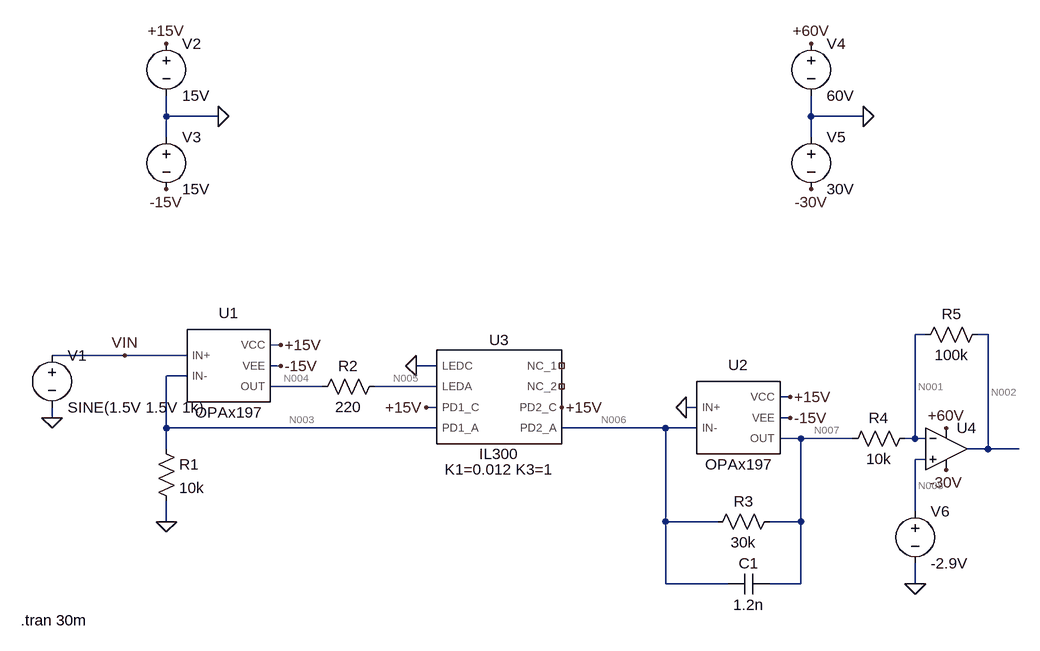
[diagram p0: schematic amplifier.asc]
amplifier.asc, the LTspice schematic file:
Version 4.1
SHEET 1 1092 680
WIRE -224 -272 -224 -304
WIRE -144 -272 -224 -272
WIRE 768 -272 768 -304
WIRE 848 -272 768 -272
WIRE -224 -240 -224 -272
WIRE 768 -240 768 -272
WIRE 944 64 928 64
WIRE 1040 64 1024 64
WIRE -48 80 -64 80
WIRE -288 96 -400 96
WIRE -192 96 -288 96
WIRE -48 112 -64 112
WIRE 192 112 160 112
WIRE -192 128 -224 128
WIRE 16 144 -64 144
WIRE 192 144 96 144
WIRE 736 160 720 160
WIRE 192 176 176 176
WIRE 592 176 576 176
WIRE -400 192 -400 176
WIRE 736 192 720 192
WIRE -224 208 -224 128
WIRE 192 208 -224 208
WIRE 544 208 384 208
WIRE 592 208 544 208
WIRE 752 224 720 224
WIRE 832 224 752 224
WIRE 928 224 928 64
WIRE 928 224 912 224
WIRE 944 224 928 224
WIRE -224 240 -224 208
WIRE 1040 240 1040 64
WIRE 1040 240 1008 240
WIRE 1088 240 1040 240
WIRE 944 256 928 256
WIRE 928 336 928 256
WIRE -224 352 -224 320
WIRE 544 352 544 208
WIRE 624 352 544 352
WIRE 752 352 752 224
WIRE 752 352 704 352
WIRE 544 448 544 352
WIRE 640 448 544 448
WIRE 752 448 752 352
WIRE 752 448 704 448
WIRE 928 448 928 416
FLAG -400 192 0
FLAG 160 112 0
FLAG -144 -272 0
FLAG -224 -160 -15V
FLAG -224 -384 +15V
FLAG -48 80 +15V
FLAG 176 176 +15V
FLAG -224 352 0
FLAG 384 176 +15V
FLAG 576 176 0
FLAG 736 160 +15V
FLAG 736 192 -15V
FLAG -48 112 -15V
FLAG 848 -272 0
FLAG 768 -160 -30V
FLAG 768 -384 +60V
FLAG 976 208 +60V
FLAG 976 272 -30V
FLAG 928 448 0
FLAG -288 96 VIN
SYMBOL library\\OPAx197 -128 112 R0
SYMATTR InstName U1
SYMBOL library\\OPAx197 656 192 R0
SYMATTR InstName U2
SYMBOL library\\IL300 288 160 R0
SYMATTR InstName U3
SYMBOL res -240 224 R0
SYMATTR InstName R1
SYMATTR Value 10k
SYMBOL res 112 128 R90
WINDOW 0 0 56 VBottom 2
WINDOW 3 32 56 VTop 2
SYMATTR InstName R2
SYMATTR Value 220
SYMBOL voltage -224 -400 R0
WINDOW 123 0 0 Left 0
WINDOW 39 0 0 Left 0
SYMATTR InstName V2
SYMATTR Value 15V
SYMBOL voltage -224 -256 R0
SYMATTR InstName V3
SYMATTR Value 15V
SYMBOL res 720 336 R90
WINDOW 0 0 56 VBottom 2
WINDOW 3 32 56 VTop 2
SYMATTR InstName R3
SYMATTR Value 30k
SYMBOL cap 704 432 R90
WINDOW 0 0 32 VBottom 2
WINDOW 3 32 32 VTop 2
SYMATTR InstName C1
SYMATTR Value 1.2n
SYMBOL voltage -400 80 R0
WINDOW 123 0 0 Left 0
WINDOW 39 0 0 Left 0
SYMATTR InstName V1
SYMATTR Value SINE(1.5V 1.5V 1k)
SYMBOL OpAmps\\UniversalOpAmp 976 240 R0
SYMATTR InstName U4
SYMBOL voltage 768 -400 R0
WINDOW 123 0 0 Left 0
WINDOW 39 0 0 Left 0
SYMATTR InstName V4
SYMATTR Value 60V
SYMBOL voltage 768 -256 R0
SYMATTR InstName V5
SYMATTR Value 30V
SYMBOL res 928 208 R90
WINDOW 0 0 56 VBottom 2
WINDOW 3 32 56 VTop 2
SYMATTR InstName R4
SYMATTR Value 10k
SYMBOL res 1040 48 R90
WINDOW 0 0 56 VBottom 2
WINDOW 3 32 56 VTop 2
SYMATTR InstName R5
SYMATTR Value 100k
SYMBOL voltage 928 320 R0
SYMATTR InstName V6
SYMATTR Value -2.9V
TEXT -448 504 Left 2 !.tran 30m

The netlist it stands for:
* amplifier.asc
X§U1 VIN N003 +15V -15V N004 OPAx197  ; pins IN+ IN- VCC VEE OUT
X§U2 0 N006 +15V -15V N007 OPAx197  ; pins IN+ IN- VCC VEE OUT
X§U3 0 N005 +15V N003 NC_01 NC_02 +15V N006 IL300 K1=0.012 K3=1  ; pins LEDC LEDA PD1_C PD1_A NC_1 NC_2 PD2_C PD2_A
R1 N003 0 10k
R2 N005 N004 220
V2 +15V 0 15V
V3 0 -15V 15V
R3 N007 N006 30k
C1 N007 N006 1.2n
V1 VIN 0 SINE(1.5V 1.5V 1k)
X§U4 N008 N001 +60V -30V N002 level1 Avol=1Meg GBW=10Meg Vos=0 En=0 Enk=0 In=0 Ink=0 Rin=500Meg  ; pins In+ In- V+ V- OUT
V4 +60V 0 60V
V5 0 -30V 30V
R4 N001 N007 10k
R5 N002 N001 100k
V6 N008 0 -2.9V
.tran 30m
.lib OPAx197.LIB
.lib IL300.lib
.lib UniversalOpAmp1.lib
.backanno
.end

* Results of the author's LTspice run, read from the files saved beside the schematic
* Operating Point, zero values left out:
*   V(+15v) = 15 V
*   V(+60v) = 60 V
*   V(-15v) = -15 V
*   V(-30v) = -30 V
*   V(n001) = -2.9 V
*   V(n002) = 13.1 V
*   V(n003) = 1.5 V
*   V(n004) = 4.023 V
*   V(n005) = 1.273 V
*   V(n006) = 24.51 µV
*   V(n007) = -4.5 V
*   V(n008) = -2.9 V
*   V(vin) = 1.5 V
*   I(R1) = 150 µA
*   I(R2) = -12.5 mA
*   I(R3) = -150 µA
*   I(R4) = 160 µA
*   I(R5) = 160 µA
*   I(V1) = -12.58 pA
*   I(V2) = -14.8 mA
*   I(V3) = -2.31 mA
*   I(V4) = -125.8 nA
*   I(V5) = -54.2 nA
*   I(V6) = 35.8 nA